# Altium schematic sheet Sheet1.SchDoc
size A4; SheetNumber: 1; SheetTotal: 1
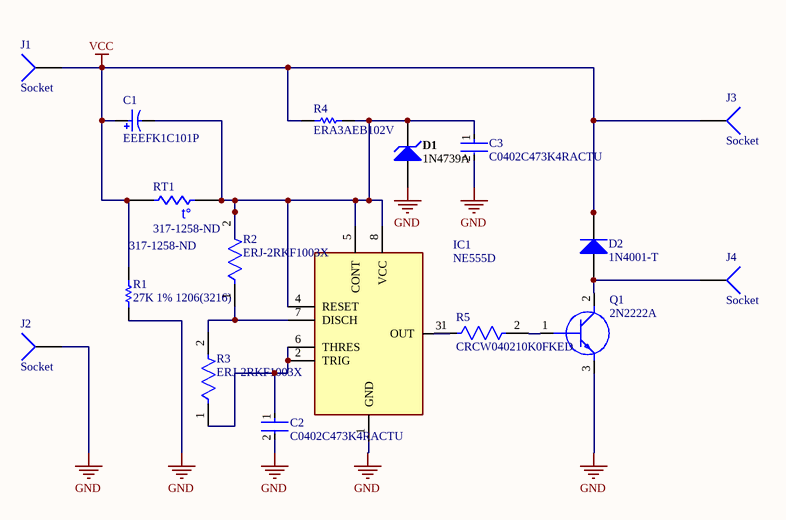
[diagram p0: Sheet1.SchDoc]

## Parts
C1  EEEFK1C101P  [PNSC-EEEFK1C101P_L]
C2  C0402C473K4RACTU  [FP-C0402-BB-MFG]
C3  C0402C473K4RACTU  [FP-C0402-BB-MFG]
D1  1N4739A  [FAIR-DO-41-2_V]
D2  1N4001-T  [DIOD-DO-41-P-2_V]
IC1  NE555D  [SOIC127P600X175-8N]
J1  Socket  [PIN1]
J2  Socket  [PIN1]
J3  Socket  [PIN1]
J4  Socket  [PIN1]
Q1  2N2222A  [TO-18_4]
R1  27K 1% 1206(3216)  [RESC1206(3216)_M]
R2  ERJ-2RKF1003X  [FP-ERJ2RK-IPC_C]
R3  ERJ-2RKF1003X  [FP-ERJ2RK-IPC_C]
R4  ERA3AEB102V  [RESC1608X55X30LL20T20]
R5  CRCW040210K0FKED  [FP-CRCW0402-e3-MFG]
RT1  317-1258-ND  [6-0805_N]

## Nets
GND: C2.2 C3.2 D1.1(A) IC1.1(GND) J2.1 Q1.3(E) R1.1
VCC: C1.1 D2.2(K) J1.1 J3.1 R1.2 R4.1 RT1.2
NetC1_2: C1.2 C3.1 D1.2(K) IC1.4(RESET) IC1.5(CONT) IC1.8(VCC) R2.2 R4.2 RT1.1
NetC2_1: C2.1 IC1.2(TRIG) IC1.6(THRES) R3.1
NetD2_1: D2.1(A) J4.1 Q1.2(C)
NetIC1_3: IC1.3(OUT) R5.1
NetIC1_7: IC1.7(DISCH) R2.1 R3.2
NetQ1_1: Q1.1(B) R5.2

## Notes on the sheet
- (in symbol Res Thermal) t°

## Library data of the parts
C1 = CMP-2000-06203-1: Aluminum Electrolytic Capacitor, 100 uF, 20%, 16 V, -55 to 105 degC, 2-Pin SMD, RoHS, Tape and Reel; Manufacturer: Panasonic; Lifetime@Temperature: 2000Hrs@105°C; Impedance: 0.36O; Ripple Current: 240mA; Rated Voltage: 16V; Type: Can; Capacitance: 100µF; Datasheet URL: http://datasheet.octopart.com/EEEFK1C101P-Panasonic-datasheet-13266987.pdf; Package Description: 2-Pin Surface Mount Device, Body 6.6 x 6.6 mm; Manufacturer URL: http://www.panasonic.com/; Case Size/Dimension: Ø6.3x5.8mm; Series: FK; Datasheet Version: 11/2012; Mounting Technology: SurfaceMount; Package Reference: EEEFK1C101P; Operating Temp-Max: 105°C; Operating Temp Range: -55to+105°C
C2 C3 = CMP-2008-03221-2: Cap Ceramic 0.047uF 16V X7R 10% SMD 0402 125°C Paper T/R; Manufacturer: Kemet; Tolerance: 0.1; Description: C0402 47,000 pF X7R 10.00% 16 V; Value: 47,000 pF; Temperature Coefficient: 15%; Material: Ceramic; Mouser Description: Multilayer Ceramic Capacitors MLCC - SMD/SMT 16volts 47000pF X7R 10%; ComponentLink2Description: Datasheet; Temperature Characteristic: X7R; Automotive: No; Package: C0402-BB; Height: 0.55mm; Manufacturer Part Number: C0402C473K4RACTU; Ipc Land Pattern Name: CAPC10050X50; Temperature: -55°C to +125°C; ComponentLink2URL: https://content.kemet.com/datasheets/KEM_C1002_X7R_SMD.pdf; RoHS: TRUE; Capacitance: 47,000 pF; Temperature Range High: +125°C; Digikey Description: Cap Ceramic 0.047uF 16V X7R 10% SMD 0402 125°C Paper T/R; Octopart: https://octopart.com/c0402c473k4ractu-kemet-145703; Lead Free: Yes; Device Class L2: Capacitors; Voltage Rating: 16 V; Temperature Range Low: -55°C; Device Class L1: Passive Components; Category: Cap; Device Class L3: Ceramic Capacitors
D1 = CMP-0892-00007-1: Zener Diode, 9.1V, 1W, 5%, -65 to 200 degC, 2-Pin DO-41, Body 2.72 x 5.2 mm, RoHS; Manufacturer: Fairchild Semiconductor; PD (W): 1; Test Current IZ (mA): 28; VZ (Max.) (V): 9.555; IR (uA): 10; VZ (Min.) (V): 8.645; ZZ (Max) (ohm): 4.5; PackageVersion: Rev. 2; Tolerance: 5%; RoHS: TRUE; ComponentLink1URL: http://www.fairchildsemi.com/; Mounting Technology: Through Hole; ComponentLink3URL: http://www.fairchildsemi.com/dwg/DO/DO41A.pdf; ComponentLink2Description: Datasheet; ComponentLink3Description: Package Specification; ComponentLink2URL: http://www.fairchildsemi.com/ds/1N/1N4744A.pdf; PartNumber: 1N4739A; Operating and Storage Temperature Range: -65 to 200 degC; PackageReference: DO-41-2; DatasheetVersion: Rev. H3; ComponentLink1Description: Manufacturer URL; PackageDescription: 2-Pin Axial leaded, Body 2.72 x 5.2 mm, Lead Spread 25.4 mm
D2 = CMP-0639-00006-2: 1.0 A Rectifier, 15 pF, 50 V, -65 to 150 degC, 2-Pin DO-41 Plastic, RoHS, Tape and Reel; Manufacturer: Diodes Inc; VF (V): 1; CT (pF): 15; Max. IR (uA): 5; VRRM (V): 50; Max. IFSM (A): 30; RoHS: TRUE; Mounting Technology: Through Hole; PartNumber: 1N4001-T; ComponentLink2Description: Datasheet; DatasheetVersion: Rev. 8-2; Operating Temperature Range (degC): -65 to 150; Packing: Tape and Reel; PackageReference: DO-41-P-2; ComponentLink1URL: http://diodes.com/; PackageDescription: 2-Pin Axial Lead, Body 4.635 x 2.36 mm, Lead Spread 25.4 mm; ComponentLink2URL: http://diodes.com/datasheets/ds28002.pdf; Max. Average Rectified Current IO (A): 1; ComponentLink1Description: Manufacturer URL
IC1 = NE555D: Integrated Circuit; Manufacturer_Name: Texas Instruments; Datasheet Link: http://www.ti.com/lit/ds/symlink/ne555.pdf; Height: 1.75mm; Manufacturer_Part_Number: NE555D; Mouser Part Number: 595-NE555D; Mouser Price/Stock: https://www.mouser.co.uk/ProductDetail/Texas-Instruments/NE555D?qs=gb35HGp1gQIV8t3Z88o0WA%3D%3D; Arrow Part Number: NE555D; Arrow Price/Stock: https://www.arrow.com/en/products/ne555d/texas-instruments?region=nac
Q1 = 2N2222A: Transistor BJT NPN; Manufacturer_Name: STMicroelectronics; Datasheet Link: http://docs-emea.rs-online.com/webdocs/0e77/0900766b80e779e1.pdf; Manufacturer_Part_Number: 2N2222A; Mouser Part Number: 511-2N2222A; Mouser Price/Stock: https://www.mouser.co.uk/ProductDetail/STMicroelectronics/2N2222A?qs=UMEuL5FsraBzcgM1cdcH3A%3D%3D
R1 = CMP-1014-00670-1: 27K 0.25W 1% 1206 (3216 Metric)  SMD; Value: 27000.00 Ohm; Case-EIA: 1206; Case-Metric: 3216; Power: 0.25 W; Tolerance: 1 %; Technology: SMT
R2 R3 = CMP-2002-00608-4: RES SMD 100K OHM 1% 1/10W 0402; Resistance: 100kR; Voltage Rating (DC): 50V; Power Rating: 100mW; Temperature Coefficient: 100ppm/°C; Case/Package: 0402; Length: 1mm; Package Quantity: 1; Radiation Hardening: No; Case Code (Metric): 1005; Contact Plating: Tin; Mount: Surface Mount; Depth: 0.5mm; Max Operating Temperature: 155°C; Lead Free: Lead Free; Width: 0.5mm; Composition: Thick Film; Case Code (Imperial): 0402; Tolerance: 1%; Termination: SMD/SMT; Number of Pins: 2; Height: 0.35mm; Voltage Rating: 50V; Military Standard: Not; REACH SVHC: No SVHC; Packaging: Tape and Reel; Min Operating Temperature: -55°C; Max Power Dissipation: 100mW; Features: Automotive AEC-Q200; Number of Terminations: 2
R4 = CMP-2000-00873-1: Manufacturer: Panasonic; Part Number: ERA3AEB102V
R5 = CMP-2002-08135-2: RES SMD 10K OHM 1% 1/16W 0402; Power Rating: 63mW; Resistance: 10kR; Voltage Rating: 50V; Temperature Coefficient: 100ppm/°C; Case Code (Metric): 1005; Features: Automotive AEC-Q200; Termination: SMD/SMT; Mount: Surface Mount; Package Quantity: 10; Packaging: Tape and Reel; Case Code (Imperial): 0402; Weight: 2.3E-05oz; Lead Free: Lead Free; Width: 0.02inch; Max Power Dissipation: 63mW; Tolerance: 1%; Number of Terminations: 2; Height: 0.35mm; Number of Pins: 2; Composition: Thick Film; Length: 1mm; Voltage Rating (DC): 50V; Case/Package: 0402; Radiation Hardening: No; Contact Plating: Tin; Depth: 0.5mm; Military Standard: Not; Min Operating Temperature: -55°C; Max Operating Temperature: 155°C
RT1 = Res Thermal: THERMISTOR NTC 10KOHM 3470K BEAD; Manufacturer: Canadian Thermostats; Manufacturer Part Number: MF52A2103J3470; Tolerance: 5%; Max Power Dissipation: 50mW; Published: 24-Mar-1999; LatestRevisionDate: 29-May-2009; LatestRevisionNote: IPC-7351 Footprint Added.; PackageVersion: Mar-2003; PackageReference: 6-0805; Publisher: Altium Limited; PackageDescription: Chip Resistor 0805 Case Size; Code_IPC: RESC2012; Supplier 1: Digi-Key; Supplier Part Number 1: 317-1258-ND; RoHS: Yes; Category: Thermistors; Stock 1: 24805; Pricing 1: 1=0,51000, 5=0,45600, 10=0,40500, 25=0,36280, 50=0,31880, 100=0,27170, 500=0,22468, 1000=0,18810, 5000=0,16720 (USD); Mount: Through Hole; Min Operating Temperature: -55°C; Max Operating Temperature: 125°C; Package Quantity: 500; Packaging: Bulk; ComponentLink1URL: https://datasheet.ciiva.com/2849/cantherm-mf52-1-2849107.pdf?src-supplier=Digi-Key; ComponentLink1Description: https://datasheet.ciiva.com/2849/cantherm-mf52-1-2849107.pdf?src-supplier=Digi-Key
J1-J4 = Socket: LatestRevisionDate: 17-Jul-2002; LatestRevisionNote: Re-released for DXP Platform.; Publisher: Altium Limited